# Altium schematic sheet led-relay.SchDoc
size A; SheetNumber: 1; SheetTotal: 1
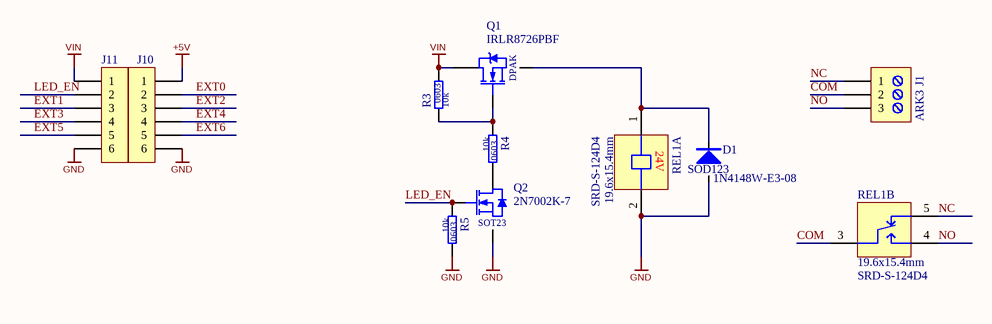
[diagram p0: led-relay.SchDoc]

## Parts
D1  value 1N4148W-E3-08  [SOD123]  (hidden comment: 1N4148W)
J1  ARK3  [J_ARK3]
J10  Goldpin  [P_HEADER_1x6_2.54]  (value not drawn)
J11  Goldpin  [P_HEADER_1x6_2.54]  (value not drawn)
Q1  SCH_Footprint: DPAK  [DPAK_TO252-3_SC63_M]  (hidden comment: IRLR8726PBF)
Q2  SCH_Footprint: SOT23  [SOT23_TO236_SC59]  (hidden comment: 2N7002K-7)
R3  value 10k  SCH_Footprint: 0603  [R_0603_1608]  (hidden comment: Resistor)
R4  value 10k  SCH_Footprint: 0603  [R_0603_1608]  (hidden comment: Resistor)
R5  value 10k  SCH_Footprint: 0603  [R_0603_1608]  (hidden comment: Resistor)
REL1  value SRD-S-124D4  SCH_Footprint: 19.6x15.4mm  [SRD-S-124D4]  (hidden comment: SPDT)  (parts A,B of 2)

## Nets
+5V: J10.1
GND: D1.2 J10.6 J11.6 Q2.2(S) R5.2 REL1.2
VIN: J11.1 Q1.2(D) R3.2
COM: J1.2 REL1.3
EXT0: J10.2
EXT1: J11.3
EXT2: J10.3
EXT3: J11.4
EXT4: J10.4
EXT5: J11.5
EXT6: J10.5
LED_EN: J11.2 Q2.1(G) R5.1
NC: J1.1 REL1.5
NO: J1.3 REL1.4
NetD1_1: D1.1 Q1.3(S) REL1.1
NetQ1_1: Q1.1(G) R3.1 R4.1
NetQ2_3: Q2.3(D) R4.2

## Library data of the parts
D1 = D_1N4148W_0A15_75V_SOD123: Manufacturer: Vishay; Voltage: 75; Current: 0.15A; SCH_Footprint: SOD123; Part Number: D_1N4148W_0A15_75V_SOD123; HelpURL: https://datasheet.octopart.com/1N4148W-E3-08-Vishay-datasheet-17291302.pdf; Manufacturer Part Number: 1N4148W-E3-08; Supplier 1: TME; Supplier Part Number 1: 1N4148W-E3-08; Supplier 2: RS Components; Supplier Part Number 2: 7003671; Supplier 3: Farnell; Supplier Part Number 3: 2433353; Supplier 4: Mouser; Supplier Part Number 4: 78-1N4148W-E3-08; Supplier 5: Digi-Key; Supplier Part Number 5: 1N4148W-E3-08CT-ND; Supplier 6: LCSC
J1 = J_TB-5.0-P-3P: ARK Screw terminal, 3-Pin; Manufacturer: DEGSON ELECTRONICS; Value: DG301-5.0-03P-12-18A(H); SCH_Footprint: ARK3; Part Number: J_TB-5.0-P-3P; HelpURL: https://datasheet.octopart.com/DG301-5.0-03P-12-18A%28H%29-Degson-datasheet-17801202.pdf; Manufacturer Part Number: DG301-5.0-03P-12-18A(H); Supplier 1: TME; Supplier Part Number 1: DG301-5.0-3/6B; Supplier 2: RS Components; Supplier 3: Farnell; Supplier 4: Mouser; Supplier 5: Digi-Key; Supplier 6: LCSC
J10 J11 = P_HEADER_1x6_2.54: Pin Header; Manufacturer: Connfly; SCH_Footprint: 1x6 2.54mm; Value: DS1021-1*6SF1-1; Part Number: P_HEADER_1x6_2.54; HelpURL: http://www.tme.eu/en/Document/cc301e58a5da78cb543a94b5a5b7f06a/DS1021.pdf; Manufacturer Part Number: DS1021-1*6SF1-1; Supplier 1: TME; Supplier Part Number 1: ZL201-06G; Supplier 2: RS Components; Supplier 3: Farnell; Supplier 4: Mouser; Supplier 5: Digi-Key; Supplier 6: LCSC
Q1 = QNS_IRLR8726PBF: Manufacturer: Infineon; Type: N-MOS; Voltage: 30V; Current: 86A; Value: IRLR8726PBF; Part Number: QNS_IRLR8726PBF; HelpURL: http://www.mouser.com/ds/2/196/irlr8726pbf-938054.pdf; Manufacturer Part Number: IRLR8726PBF; Supplier 1: TME; Supplier Part Number 1: IRLR8726PBF; Supplier 2: RS Components; Supplier 3: Farnell; Supplier 4: Mouser; Supplier Part Number 4: 942-IRLR8726PBF; Supplier 5: Digi-Key; Supplier Part Number 5: IRLR8726PBF-ND; Supplier 6: LCSC
Q2 = QN_2N7002K-7: Manufacturer: Diodes Inc; Type: N-MOS; Voltage: 60V; Current: 0A8; Value: 2N7002K-7; Part Number: QN_2N7002K-7; HelpURL: http://datasheet.octopart.com/2N7002K-7-Diodes-Inc.-datasheet-12515815.pdf; Manufacturer Part Number: 2N7002K-7; Supplier 1: TME; Supplier 2: RS Components; Supplier Part Number 2: 7703383; Supplier 3: Farnell; Supplier Part Number 3: 1713825; Supplier 4: Mouser; Supplier Part Number 4: 621-2N7002K-7; Supplier 5: Digi-Key; Supplier Part Number 5: 2N7002K-7DICT-ND; Supplier 6: LCSC
R3-R5 = R_10k_0603_1: Manufacturer: Vishay; Manufacturer Part Number: CRCW060310K0FKTA; Voltage: 75V; Power: 100mW; Tolerance: 1%; Part Number: R_10k_0603_1; HelpURL: https://octopart.com/datasheet/crcw060310k0fkta-vishay-39447548; Supplier 1: TME; Supplier Part Number 1: CRCW060310K0FKTABC; Supplier 2: RS Components; Supplier 3: Farnell; Supplier Part Number 3: 1652827; Supplier 4: Mouser; Supplier Part Number 4: 71-CRCW0603-10K; Supplier 5: Digi-Key; Supplier Part Number 5: 541-2980-1-ND; Supplier 6: LCSC
REL1 = REL_SRD-S-124D4: Manufacturer: Sanyou; Voltage: 24V; Current: 10A; Part Number: REL_SRD-S-124D4; HelpURL: https://www.tme.eu/Document/44da8ad0eef567e3e4f0ea3e928322de/SDR-Datasheet.pdf; Manufacturer Part Number: SRD-S-124D4; Supplier 1: TME; Supplier Part Number 1: SRD-S-124D4; Supplier 2: RS Components; Supplier 3: Farnell; Supplier 4: Mouser; Supplier 5: Digi-Key; Supplier 6: LCSC